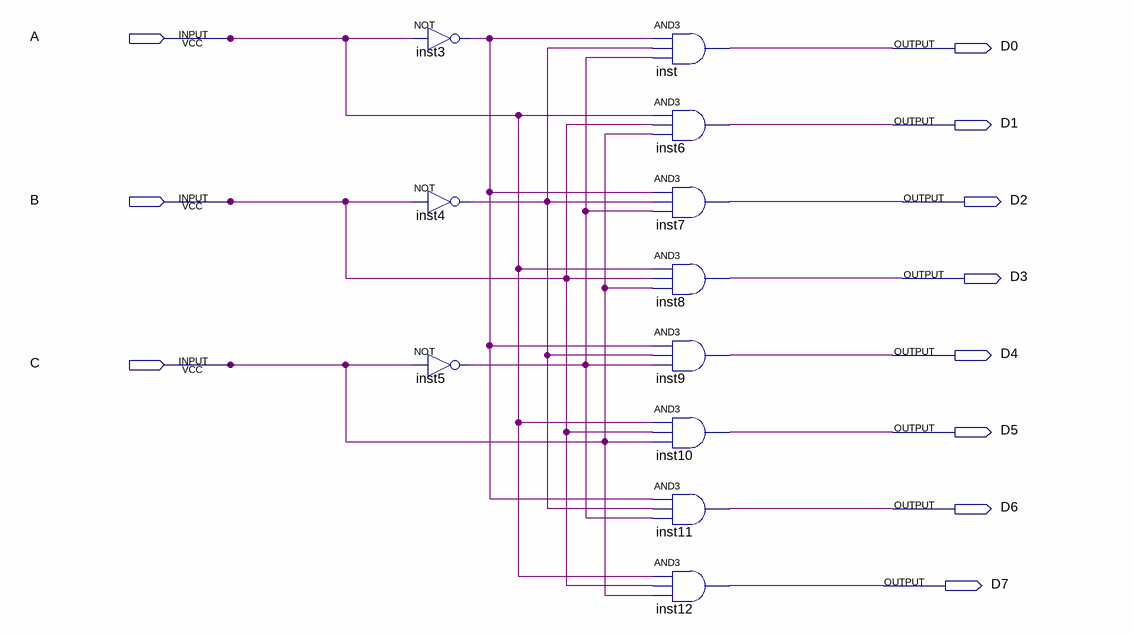
[diagram p0: schematic sheet]
// Quartus schematic 3-8decoder.bdf as structural Verilog: 11 symbols, 11 pins
module \3-8decoder  (
  input  A,
  input  B,
  input  C,
  output D0,
  output D1,
  output D2,
  output D3,
  output D4,
  output D5,
  output D6,
  output D7
);

  wire inst3_out, inst4_out, inst5_out;

  not inst3 (inst3_out, A);
  not inst4 (inst4_out, B);
  not inst5 (inst5_out, C);
  and inst (D0, inst3_out, inst4_out, inst5_out);
  and inst6 (D1, A, B, C);
  and inst7 (D2, inst3_out, inst4_out, inst5_out);
  and inst8 (D3, A, B, C);
  and inst9 (D4, inst3_out, inst4_out, inst5_out);
  and inst10 (D5, A, B, C);
  and inst11 (D6, inst3_out, inst4_out, inst5_out);
  and inst12 (D7, A, B, C);
endmodule
